# Altium schematic sheet 通用工装板03.SchDoc
size A2; Date: 20190212; CompanyName: 瑞臻信息（深圳）有限公司; DrawnBy: BOB.XU; Address1: 深圳市南山区深南路万利达大厦2201室; Address2: 昆山市花桥镇花桥国际商务城绿地大道231弄9号楼杰座大厦2111室; Address3: 成都市高新区天府二街138号蜀都中心3号楼3110室; Address4: 浙江省宁波市余姚市冶山路475号1401室; Revision: V1.00; SheetOf: 3/3; ProductTitle: 通用测试工装; ModuleTitle: power; : CheckedBy
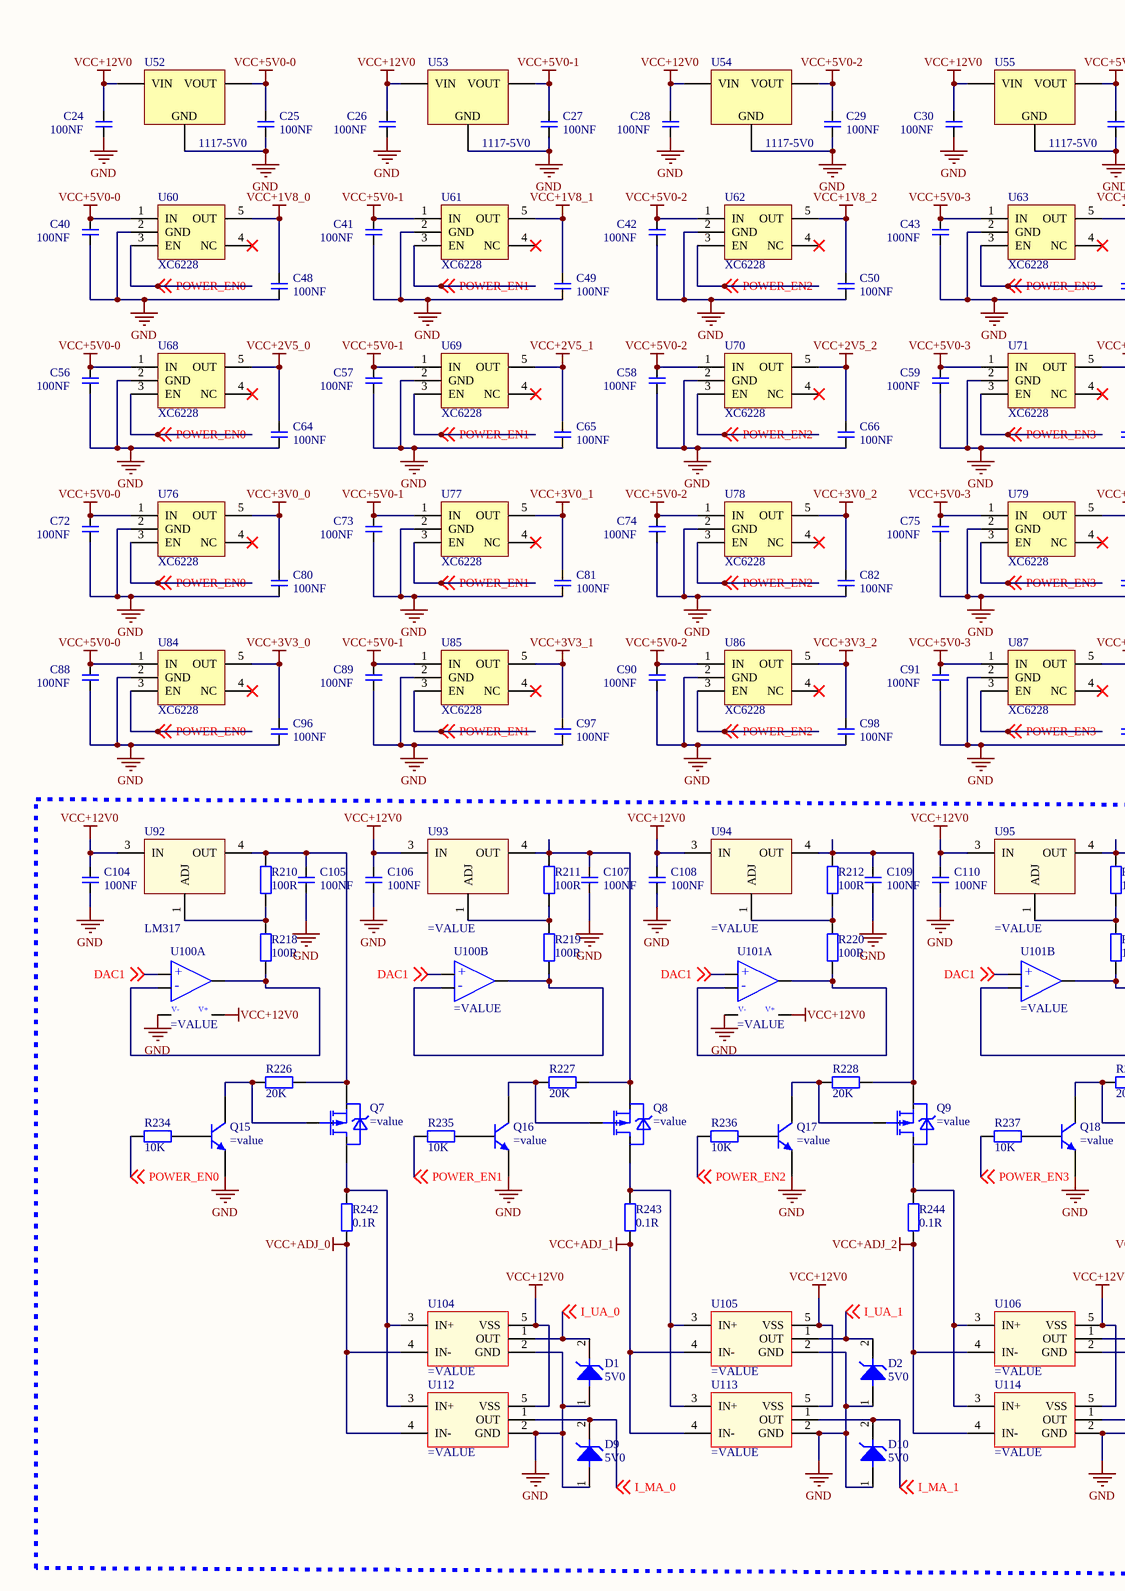
[diagram p0: 通用工装板03.SchDoc, left]
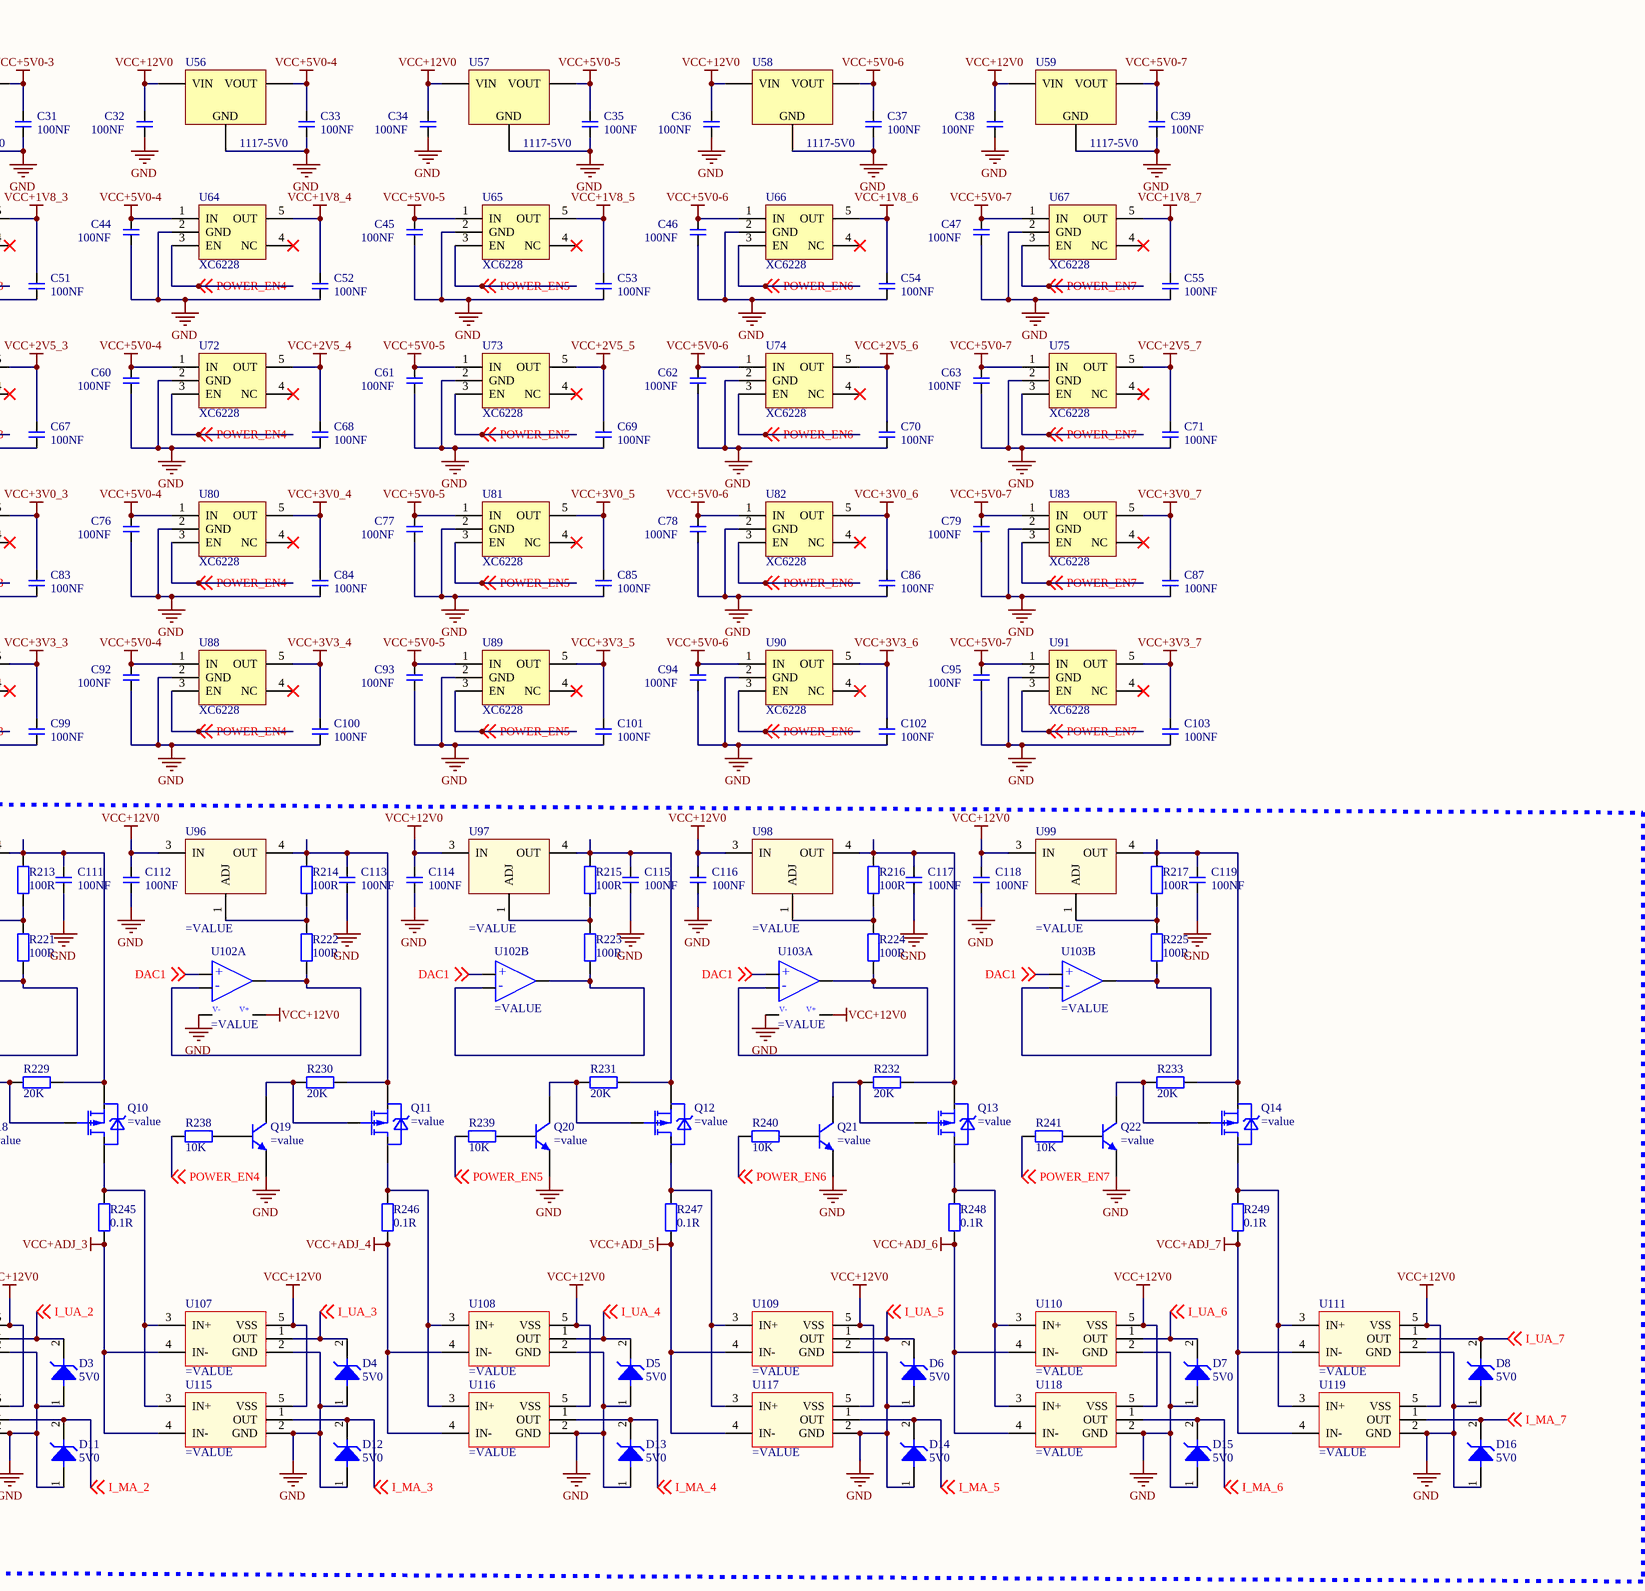
[diagram p1: 通用工装板03.SchDoc, right]

## Parts
C24  100NF  [c0402]
C25  100NF  [c0402]
C26  100NF  [c0402]
C27  100NF  [c0402]
C28  100NF  [c0402]
C29  100NF  [c0402]
C30  100NF  [c0402]
C31  100NF  [c0402]
C32  100NF  [c0402]
C33  100NF  [c0402]
C34  100NF  [c0402]
C35  100NF  [c0402]
C36  100NF  [c0402]
C37  100NF  [c0402]
C38  100NF  [c0402]
C39  100NF  [c0402]
C40  100NF  [c0402]
C41  100NF  [c0402]
C42  100NF  [c0402]
C43  100NF  [c0402]
C44  100NF  [c0402]
C45  100NF  [c0402]
C46  100NF  [c0402]
C47  100NF  [c0402]
C48  100NF  [c0402]
C49  100NF  [c0402]
C50  100NF  [c0402]
C51  100NF  [c0402]
C52  100NF  [c0402]
C53  100NF  [c0402]
C54  100NF  [c0402]
C55  100NF  [c0402]
C56  100NF  [c0402]
C57  100NF  [c0402]
C58  100NF  [c0402]
C59  100NF  [c0402]
C60  100NF  [c0402]
C61  100NF  [c0402]
C62  100NF  [c0402]
C63  100NF  [c0402]
C64  100NF  [c0402]
C65  100NF  [c0402]
C66  100NF  [c0402]
C67  100NF  [c0402]
C68  100NF  [c0402]
C69  100NF  [c0402]
C70  100NF  [c0402]
C71  100NF  [c0402]
C72  100NF  [c0402]
C73  100NF  [c0402]
C74  100NF  [c0402]
C75  100NF  [c0402]
C76  100NF  [c0402]
C77  100NF  [c0402]
C78  100NF  [c0402]
C79  100NF  [c0402]
C80  100NF  [c0402]
C81  100NF  [c0402]
C82  100NF  [c0402]
C83  100NF  [c0402]
C84  100NF  [c0402]
C85  100NF  [c0402]
C86  100NF  [c0402]
C87  100NF  [c0402]
C88  100NF  [c0402]
C89  100NF  [c0402]
C90  100NF  [c0402]
C91  100NF  [c0402]
C92  100NF  [c0402]
C93  100NF  [c0402]
C94  100NF  [c0402]
C95  100NF  [c0402]
C96  100NF  [c0402]
C97  100NF  [c0402]
C98  100NF  [c0402]
C99  100NF  [c0402]
C100  100NF  [c0402]
C101  100NF  [c0402]
C102  100NF  [c0402]
C103  100NF  [c0402]
C104  100NF  [c0402]
C105  100NF  [c0402]
C106  100NF  [c0402]
C107  100NF  [c0402]
C108  100NF  [c0402]
C109  100NF  [c0402]
C110  100NF  [c0402]
C111  100NF  [c0402]
C112  100NF  [c0402]
C113  100NF  [c0402]
C114  100NF  [c0402]
C115  100NF  [c0402]
C116  100NF  [c0402]
C117  100NF  [c0402]
C118  100NF  [c0402]
C119  100NF  [c0402]
D1  5V0  [LL34_2P_D1R5H3R7]
D2  5V0  [LL34_2P_D1R5H3R7]
D3  5V0  [LL34_2P_D1R5H3R7]
D4  5V0  [LL34_2P_D1R5H3R7]
D5  5V0  [LL34_2P_D1R5H3R7]
D6  5V0  [LL34_2P_D1R5H3R7]
D7  5V0  [LL34_2P_D1R5H3R7]
D8  5V0  [LL34_2P_D1R5H3R7]
D9  5V0  [LL34_2P_D1R5H3R7]
D10  5V0  [LL34_2P_D1R5H3R7]
D11  5V0  [LL34_2P_D1R5H3R7]
D12  5V0  [LL34_2P_D1R5H3R7]
D13  5V0  [LL34_2P_D1R5H3R7]
D14  5V0  [LL34_2P_D1R5H3R7]
D15  5V0  [LL34_2P_D1R5H3R7]
D16  5V0  [LL34_2P_D1R5H3R7]
Q7  (no value)  [SOT23_3P_0R95_1R3X2R9]
Q8  (no value)  [SOT23_3P_0R95_1R3X2R9]
Q9  (no value)  [SOT23_3P_0R95_1R3X2R9]
Q10  (no value)  [SOT23_3P_0R95_1R3X2R9]
Q11  (no value)  [SOT23_3P_0R95_1R3X2R9]
Q12  (no value)  [SOT23_3P_0R95_1R3X2R9]
Q13  (no value)  [SOT23_3P_0R95_1R3X2R9]
Q14  (no value)  [SOT23_3P_0R95_1R3X2R9]
Q15  (no value)  [SOT23_3P_0R95_1R3X2R9]
Q16  (no value)  [SOT23_3P_0R95_1R3X2R9]
Q17  (no value)  [SOT23_3P_0R95_1R3X2R9]
Q18  (no value)  [SOT23_3P_0R95_1R3X2R9]
Q19  (no value)  [SOT23_3P_0R95_1R3X2R9]
Q20  (no value)  [SOT23_3P_0R95_1R3X2R9]
Q21  (no value)  [SOT23_3P_0R95_1R3X2R9]
Q22  (no value)  [SOT23_3P_0R95_1R3X2R9]
R210  100R  [r0402]
R211  100R  [r0402]
R212  100R  [r0402]
R213  100R  [r0402]
R214  100R  [r0402]
R215  100R  [r0402]
R216  100R  [r0402]
R217  100R  [r0402]
R218  100R  [r0402]
R219  100R  [r0402]
R220  100R  [r0402]
R221  100R  [r0402]
R222  100R  [r0402]
R223  100R  [r0402]
R224  100R  [r0402]
R225  100R  [r0402]
R226  20K  [r0402]
R227  20K  [r0402]
R228  20K  [r0402]
R229  20K  [r0402]
R230  20K  [r0402]
R231  20K  [r0402]
R232  20K  [r0402]
R233  20K  [r0402]
R234  10K  [r0402]
R235  10K  [r0402]
R236  10K  [r0402]
R237  10K  [r0402]
R238  10K  [r0402]
R239  10K  [r0402]
R240  10K  [r0402]
R241  10K  [r0402]
R242  0.1R  [r0603]
R243  0.1R  [r0603]
R244  0.1R  [r0603]
R245  0.1R  [r0603]
R246  0.1R  [r0603]
R247  0.1R  [r0603]
R248  0.1R  [r0603]
R249  0.1R  [r0603]
U52  1117-5V0  [SOT223_4P_2R3_3R7X6R7]
U53  1117-5V0  [SOT223_4P_2R3_3R7X6R7]
U54  1117-5V0  [SOT223_4P_2R3_3R7X6R7]
U55  1117-5V0  [SOT223_4P_2R3_3R7X6R7]
U56  1117-5V0  [SOT223_4P_2R3_3R7X6R7]
U57  1117-5V0  [SOT223_4P_2R3_3R7X6R7]
U58  1117-5V0  [SOT223_4P_2R3_3R7X6R7]
U59  1117-5V0  [SOT223_4P_2R3_3R7X6R7]
U60  XC6228  [SOT23_5P_0R95_1R6X2R9]
U61  XC6228  [SOT23_5P_0R95_1R6X2R9]
U62  XC6228  [SOT23_5P_0R95_1R6X2R9]
U63  XC6228  [SOT23_5P_0R95_1R6X2R9]
U64  XC6228  [SOT23_5P_0R95_1R6X2R9]
U65  XC6228  [SOT23_5P_0R95_1R6X2R9]
U66  XC6228  [SOT23_5P_0R95_1R6X2R9]
U67  XC6228  [SOT23_5P_0R95_1R6X2R9]
U68  XC6228  [SOT23_5P_0R95_1R6X2R9]
U69  XC6228  [SOT23_5P_0R95_1R6X2R9]
U70  XC6228  [SOT23_5P_0R95_1R6X2R9]
U71  XC6228  [SOT23_5P_0R95_1R6X2R9]
U72  XC6228  [SOT23_5P_0R95_1R6X2R9]
U73  XC6228  [SOT23_5P_0R95_1R6X2R9]
U74  XC6228  [SOT23_5P_0R95_1R6X2R9]
U75  XC6228  [SOT23_5P_0R95_1R6X2R9]
U76  XC6228  [SOT23_5P_0R95_1R6X2R9]
U77  XC6228  [SOT23_5P_0R95_1R6X2R9]
U78  XC6228  [SOT23_5P_0R95_1R6X2R9]
U79  XC6228  [SOT23_5P_0R95_1R6X2R9]
U80  XC6228  [SOT23_5P_0R95_1R6X2R9]
U81  XC6228  [SOT23_5P_0R95_1R6X2R9]
U82  XC6228  [SOT23_5P_0R95_1R6X2R9]
U83  XC6228  [SOT23_5P_0R95_1R6X2R9]
U84  XC6228  [SOT23_5P_0R95_1R6X2R9]
U85  XC6228  [SOT23_5P_0R95_1R6X2R9]
U86  XC6228  [SOT23_5P_0R95_1R6X2R9]
U87  XC6228  [SOT23_5P_0R95_1R6X2R9]
U88  XC6228  [SOT23_5P_0R95_1R6X2R9]
U89  XC6228  [SOT23_5P_0R95_1R6X2R9]
U90  XC6228  [SOT23_5P_0R95_1R6X2R9]
U91  XC6228  [SOT23_5P_0R95_1R6X2R9]
U92  LM317  [TO252_3P_2R3_6R2X6R7]
U93  (no value)  [TO252_3P_2R3_6R2X6R7]
U94  (no value)  [TO252_3P_2R3_6R2X6R7]
U95  (no value)  [TO252_3P_2R3_6R2X6R7]
U96  (no value)  [TO252_3P_2R3_6R2X6R7]
U97  (no value)  [TO252_3P_2R3_6R2X6R7]
U98  (no value)  [TO252_3P_2R3_6R2X6R7]
U99  (no value)  [TO252_3P_2R3_6R2X6R7]
U100  (no value)  [SOP_8P_1R27_3R9X4R9]  (parts A,B of 2)
U101  (no value)  [SOP_8P_1R27_3R9X4R9]  (parts A,B of 2)
U102  (no value)  [SOP_8P_1R27_3R9X4R9]  (parts A,B of 2)
U103  (no value)  [SOP_8P_1R27_3R9X4R9]  (parts A,B of 2)
U104  (no value)  [SOT23_5P_0R95_1R6X2R9]
U105  (no value)  [SOT23_5P_0R95_1R6X2R9]
U106  (no value)  [SOT23_5P_0R95_1R6X2R9]
U107  (no value)  [SOT23_5P_0R95_1R6X2R9]
U108  (no value)  [SOT23_5P_0R95_1R6X2R9]
U109  (no value)  [SOT23_5P_0R95_1R6X2R9]
U110  (no value)  [SOT23_5P_0R95_1R6X2R9]
U111  (no value)  [SOT23_5P_0R95_1R6X2R9]
U112  (no value)  [SOT23_5P_0R95_1R6X2R9]
U113  (no value)  [SOT23_5P_0R95_1R6X2R9]
U114  (no value)  [SOT23_5P_0R95_1R6X2R9]
U115  (no value)  [SOT23_5P_0R95_1R6X2R9]
U116  (no value)  [SOT23_5P_0R95_1R6X2R9]
U117  (no value)  [SOT23_5P_0R95_1R6X2R9]
U118  (no value)  [SOT23_5P_0R95_1R6X2R9]
U119  (no value)  [SOT23_5P_0R95_1R6X2R9]

## Nets
GND: C24.1 C25.1 C26.1 C27.1 C28.1 C29.1 C30.1 C31.1 C32.1 C33.1 C34.1 C35.1 C36.1 C37.1 C38.1 C39.1 C40.1 C41.1 C42.1 C43.1 C44.1 C45.1 C46.1 C47.1 C48.1 C49.1 C50.1 C51.1 C52.1 C53.1 C54.1 C55.1 C56.1 C57.1 C58.1 C59.1 C60.1 C61.1 C62.1 C63.1 C64.1 C65.1 C66.1 C67.1 C68.1 C69.1 C70.1 C71.1 C72.1 C73.1 C74.1 C75.1 C76.1 C77.1 C78.1 C79.1 C80.1 C81.1 C82.1 C83.1 C84.1 C85.1 C86.1 C87.1 C88.1 C89.1 C90.1 C91.1 C92.1 C93.1 C94.1 C95.1 C96.1 C97.1 C98.1 C99.1 C100.1 C101.1 C102.1 C103.1 C104.1 C105.1 C106.1 C107.1 C108.1 C109.1 C110.1 C111.1 C112.1 C113.1 C114.1 C115.1 C116.1 C117.1 C118.1 C119.1 D1.1(A) D2.1(A) D3.1(A) D4.1(A) D5.1(A) D6.1(A) D7.1(A) D8.1(A) D9.1(A) D10.1(A) D11.1(A) D12.1(A) D13.1(A) D14.1(A) D15.1(A) D16.1(A) Q15.2(E) Q16.2(E) Q17.2(E) Q18.2(E) Q19.2(E) Q20.2(E) Q21.2(E) Q22.2(E) U52.1(GND) U53.1(GND) U54.1(GND) U55.1(GND) U56.1(GND) U57.1(GND) U58.1(GND) U59.1(GND) U60.2(GND) U61.2(GND) U62.2(GND) U63.2(GND) U64.2(GND) U65.2(GND) U66.2(GND) U67.2(GND) U68.2(GND) U69.2(GND) U70.2(GND) U71.2(GND) U72.2(GND) U73.2(GND) U74.2(GND) U75.2(GND) U76.2(GND) U77.2(GND) U78.2(GND) U79.2(GND) U80.2(GND) U81.2(GND) U82.2(GND) U83.2(GND) U84.2(GND) U85.2(GND) U86.2(GND) U87.2(GND) U88.2(GND) U89.2(GND) U90.2(GND) U91.2(GND) U100.4(V-) U101.4(V-) U102.4(V-) U103.4(V-) U104.2(GND) U105.2(GND) U106.2(GND) U107.2(GND) U108.2(GND) U109.2(GND) U110.2(GND) U111.2(GND) U112.2(GND) U113.2(GND) U114.2(GND) U115.2(GND) U116.2(GND) U117.2(GND) U118.2(GND) U119.2(GND)
VCC+1V8_0: C48.2 U60.5(OUT)
VCC+1V8_1: C49.2 U61.5(OUT)
VCC+1V8_2: C50.2 U62.5(OUT)
VCC+1V8_3: C51.2 U63.5(OUT)
VCC+1V8_4: C52.2 U64.5(OUT)
VCC+1V8_5: C53.2 U65.5(OUT)
VCC+1V8_6: C54.2 U66.5(OUT)
VCC+1V8_7: C55.2 U67.5(OUT)
VCC+2V5_0: C64.2 U68.5(OUT)
VCC+2V5_1: C65.2 U69.5(OUT)
VCC+2V5_2: C66.2 U70.5(OUT)
VCC+2V5_3: C67.2 U71.5(OUT)
VCC+2V5_4: C68.2 U72.5(OUT)
VCC+2V5_5: C69.2 U73.5(OUT)
VCC+2V5_6: C70.2 U74.5(OUT)
VCC+2V5_7: C71.2 U75.5(OUT)
VCC+3V0_0: C80.2 U76.5(OUT)
VCC+3V0_1: C81.2 U77.5(OUT)
VCC+3V0_2: C82.2 U78.5(OUT)
VCC+3V0_3: C83.2 U79.5(OUT)
VCC+3V0_4: C84.2 U80.5(OUT)
VCC+3V0_5: C85.2 U81.5(OUT)
VCC+3V0_6: C86.2 U82.5(OUT)
VCC+3V0_7: C87.2 U83.5(OUT)
VCC+3V3_0: C96.2 U84.5(OUT)
VCC+3V3_1: C97.2 U85.5(OUT)
VCC+3V3_2: C98.2 U86.5(OUT)
VCC+3V3_3: C99.2 U87.5(OUT)
VCC+3V3_4: C100.2 U88.5(OUT)
VCC+3V3_5: C101.2 U89.5(OUT)
VCC+3V3_6: C102.2 U90.5(OUT)
VCC+3V3_7: C103.2 U91.5(OUT)
VCC+5V0-0: C25.2 C40.2 C56.2 C72.2 C88.2 U52.2(VOUT) U60.1(IN) U68.1(IN) U76.1(IN) U84.1(IN)
VCC+5V0-1: C27.2 C41.2 C57.2 C73.2 C89.2 U53.2(VOUT) U61.1(IN) U69.1(IN) U77.1(IN) U85.1(IN)
VCC+5V0-2: C29.2 C42.2 C58.2 C74.2 C90.2 U54.2(VOUT) U62.1(IN) U70.1(IN) U78.1(IN) U86.1(IN)
VCC+5V0-3: C31.2 C43.2 C59.2 C75.2 C91.2 U55.2(VOUT) U63.1(IN) U71.1(IN) U79.1(IN) U87.1(IN)
VCC+5V0-4: C33.2 C44.2 C60.2 C76.2 C92.2 U56.2(VOUT) U64.1(IN) U72.1(IN) U80.1(IN) U88.1(IN)
VCC+5V0-5: C35.2 C45.2 C61.2 C77.2 C93.2 U57.2(VOUT) U65.1(IN) U73.1(IN) U81.1(IN) U89.1(IN)
VCC+5V0-6: C37.2 C46.2 C62.2 C78.2 C94.2 U58.2(VOUT) U66.1(IN) U74.1(IN) U82.1(IN) U90.1(IN)
VCC+5V0-7: C39.2 C47.2 C63.2 C79.2 C95.2 U59.2(VOUT) U67.1(IN) U75.1(IN) U83.1(IN) U91.1(IN)
VCC+12V0: C24.2 C26.2 C28.2 C30.2 C32.2 C34.2 C36.2 C38.2 C104.2 C106.2 C108.2 C110.2 C112.2 C114.2 C116.2 C118.2 U52.3(VIN) U53.3(VIN) U54.3(VIN) U55.3(VIN) U56.3(VIN) U57.3(VIN) U58.3(VIN) U59.3(VIN) U92.3(IN) U93.3(IN) U94.3(IN) U95.3(IN) U96.3(IN) U97.3(IN) U98.3(IN) U99.3(IN) U100.8(V+) U101.8(V+) U102.8(V+) U103.8(V+) U104.5(VSS) U105.5(VSS) U106.5(VSS) U107.5(VSS) U108.5(VSS) U109.5(VSS) U110.5(VSS) U111.5(VSS) U112.5(VSS) U113.5(VSS) U114.5(VSS) U115.5(VSS) U116.5(VSS) U117.5(VSS) U118.5(VSS) U119.5(VSS)
VCC+ADJ_0: R242.2 U104.4(IN-) U112.4(IN-)
VCC+ADJ_1: R243.2 U105.4(IN-) U113.4(IN-)
VCC+ADJ_2: R244.2 U106.4(IN-) U114.4(IN-)
VCC+ADJ_3: R245.2 U107.4(IN-) U115.4(IN-)
VCC+ADJ_4: R246.2 U108.4(IN-) U116.4(IN-)
VCC+ADJ_5: R247.2 U109.4(IN-) U117.4(IN-)
VCC+ADJ_6: R248.2 U110.4(IN-) U118.4(IN-)
VCC+ADJ_7: R249.2 U111.4(IN-) U119.4(IN-)
DAC1: U100.3 U100.5 U101.3 U101.5 U102.3 U102.5 U103.3 U103.5 ; off-sheet DAC1
I_MA_0: D9.2(K) U112.1(OUT) ; off-sheet I_MA_0
I_MA_1: D10.2(K) U113.1(OUT) ; off-sheet I_MA_1
I_MA_2: D11.2(K) U114.1(OUT) ; off-sheet I_MA_2
I_MA_3: D12.2(K) U115.1(OUT) ; off-sheet I_MA_3
I_MA_4: D13.2(K) U116.1(OUT) ; off-sheet I_MA_4
I_MA_5: D14.2(K) U117.1(OUT) ; off-sheet I_MA_5
I_MA_6: D15.2(K) U118.1(OUT) ; off-sheet I_MA_6
I_MA_7: D16.2(K) U119.1(OUT) ; off-sheet I_MA_7
I_UA_0: D1.2(K) U104.1(OUT) ; off-sheet I_UA_0
I_UA_1: D2.2(K) U105.1(OUT) ; off-sheet I_UA_1
I_UA_2: D3.2(K) U106.1(OUT) ; off-sheet I_UA_2
I_UA_3: D4.2(K) U107.1(OUT) ; off-sheet I_UA_3
I_UA_4: D5.2(K) U108.1(OUT) ; off-sheet I_UA_4
I_UA_5: D6.2(K) U109.1(OUT) ; off-sheet I_UA_5
I_UA_6: D7.2(K) U110.1(OUT) ; off-sheet I_UA_6
I_UA_7: D8.2(K) U111.1(OUT) ; off-sheet I_UA_7
POWER_EN0: R234.2 U60.3(EN) U68.3(EN) U76.3(EN) U84.3(EN) ; off-sheet POWER_EN0
POWER_EN1: R235.2 U61.3(EN) U69.3(EN) U77.3(EN) U85.3(EN) ; off-sheet POWER_EN1
POWER_EN2: R236.2 U62.3(EN) U70.3(EN) U78.3(EN) U86.3(EN) ; off-sheet POWER_EN2
POWER_EN3: R237.2 U63.3(EN) U71.3(EN) U79.3(EN) U87.3(EN) ; off-sheet POWER_EN3
POWER_EN4: R238.2 U64.3(EN) U72.3(EN) U80.3(EN) U88.3(EN) ; off-sheet POWER_EN4
POWER_EN5: R239.2 U65.3(EN) U73.3(EN) U81.3(EN) U89.3(EN) ; off-sheet POWER_EN5
POWER_EN6: R240.2 U66.3(EN) U74.3(EN) U82.3(EN) U90.3(EN) ; off-sheet POWER_EN6
POWER_EN7: R241.2 U67.3(EN) U75.3(EN) U83.3(EN) U91.3(EN) ; off-sheet POWER_EN7
NetC105_2: C105.2 Q7.2(S) R210.2 R226.1 U92.4(OUT)
NetC107_2: C107.2 Q8.2(S) R211.2 R227.1 U93.4(OUT)
NetC109_2: C109.2 Q9.2(S) R212.2 R228.1 U94.4(OUT)
NetC111_2: C111.2 Q10.2(S) R213.2 R229.1 U95.4(OUT)
NetC113_2: C113.2 Q11.2(S) R214.2 R230.1 U96.4(OUT)
NetC115_2: C115.2 Q12.2(S) R215.2 R231.1 U97.4(OUT)
NetC117_2: C117.2 Q13.2(S) R216.2 R232.1 U98.4(OUT)
NetC119_2: C119.2 Q14.2(S) R217.2 R233.1 U99.4(OUT)
NetQ7_1: Q7.1(G) Q15.3(C) R226.2
NetQ7_3: Q7.3(D) R242.1 U104.3(IN+) U112.3(IN+)
NetQ8_1: Q8.1(G) Q16.3(C) R227.2
NetQ8_3: Q8.3(D) R243.1 U105.3(IN+) U113.3(IN+)
NetQ9_1: Q9.1(G) Q17.3(C) R228.2
NetQ9_3: Q9.3(D) R244.1 U106.3(IN+) U114.3(IN+)
NetQ10_1: Q10.1(G) Q18.3(C) R229.2
NetQ10_3: Q10.3(D) R245.1 U107.3(IN+) U115.3(IN+)
NetQ11_1: Q11.1(G) Q19.3(C) R230.2
NetQ11_3: Q11.3(D) R246.1 U108.3(IN+) U116.3(IN+)
NetQ12_1: Q12.1(G) Q20.3(C) R231.2
NetQ12_3: Q12.3(D) R247.1 U109.3(IN+) U117.3(IN+)
NetQ13_1: Q13.1(G) Q21.3(C) R232.2
NetQ13_3: Q13.3(D) R248.1 U110.3(IN+) U118.3(IN+)
NetQ14_1: Q14.1(G) Q22.3(C) R233.2
NetQ14_3: Q14.3(D) R249.1 U111.3(IN+) U119.3(IN+)
NetQ15_1: Q15.1(B) R234.1
NetQ16_1: Q16.1(B) R235.1
NetQ17_1: Q17.1(B) R236.1
NetQ18_1: Q18.1(B) R237.1
NetQ19_1: Q19.1(B) R238.1
NetQ20_1: Q20.1(B) R239.1
NetQ21_1: Q21.1(B) R240.1
NetQ22_1: Q22.1(B) R241.1
NetR210_1: R210.1 R218.2 U92.1(ADJ)
NetR211_1: R211.1 R219.2 U93.1(ADJ)
NetR212_1: R212.1 R220.2 U94.1(ADJ)
NetR213_1: R213.1 R221.2 U95.1(ADJ)
NetR214_1: R214.1 R222.2 U96.1(ADJ)
NetR215_1: R215.1 R223.2 U97.1(ADJ)
NetR216_1: R216.1 R224.2 U98.1(ADJ)
NetR217_1: R217.1 R225.2 U99.1(ADJ)
NetR218_1: R218.1 U100.1 U100.2
NetR219_1: R219.1 U100.6 U100.7
NetR220_1: R220.1 U101.1 U101.2
NetR221_1: R221.1 U101.6 U101.7
NetR222_1: R222.1 U102.1 U102.2
NetR223_1: R223.1 U102.6 U102.7
NetR224_1: R224.1 U103.1 U103.2
NetR225_1: R225.1 U103.6 U103.7

Not connected (* = marked no-connect by the designer): U60 4(NC)*; U61 4(NC)*; U62 4(NC)*; U63 4(NC)*; U64 4(NC)*; U65 4(NC)*; U66 4(NC)*; U67 4(NC)*; U68 4(NC)*; U69 4(NC)*; U70 4(NC)*; U71 4(NC)*; U72 4(NC)*; U73 4(NC)*; U74 4(NC)*; U75 4(NC)*; U76 4(NC)*; U77 4(NC)*; U78 4(NC)*; U79 4(NC)*; U80 4(NC)*; U81 4(NC)*; U82 4(NC)*; U83 4(NC)*; U84 4(NC)*; U85 4(NC)*; U86 4(NC)*; U87 4(NC)*; U88 4(NC)*; U89 4(NC)*; U90 4(NC)*; U91 4(NC)*

## Notes on the sheet
- Logo:
- Product Title:
- Product Number:
- Mod Title:
- Size:
- Mod Number:
- A2
- SheetOf:
- Revision:
- DrawnBy:
- Date:
- CheckedBy:
- (in symbol LM358, part A) +; -
- (in symbol LM358, part B) +; -

## Library data of the parts
C24-C119 = 无极性电容
D1-D16 = 齐纳二极管
Q7-Q14 = P-MOS
Q15-Q22 = NPN三极管
R210-R249 = 普通电阻
U52-U59 = AMS1117
U92-U99 = LM317-ADJ
U100-U103 = LM358
U104-U119 = INA180A